# EasyEDA schematic d_00_e_02.json
TITLE: Sheet_1; REV: 1.0; Date: 2021-02-06; Sheet: 1/1; Drawn By: ghusk; Company: Your Company
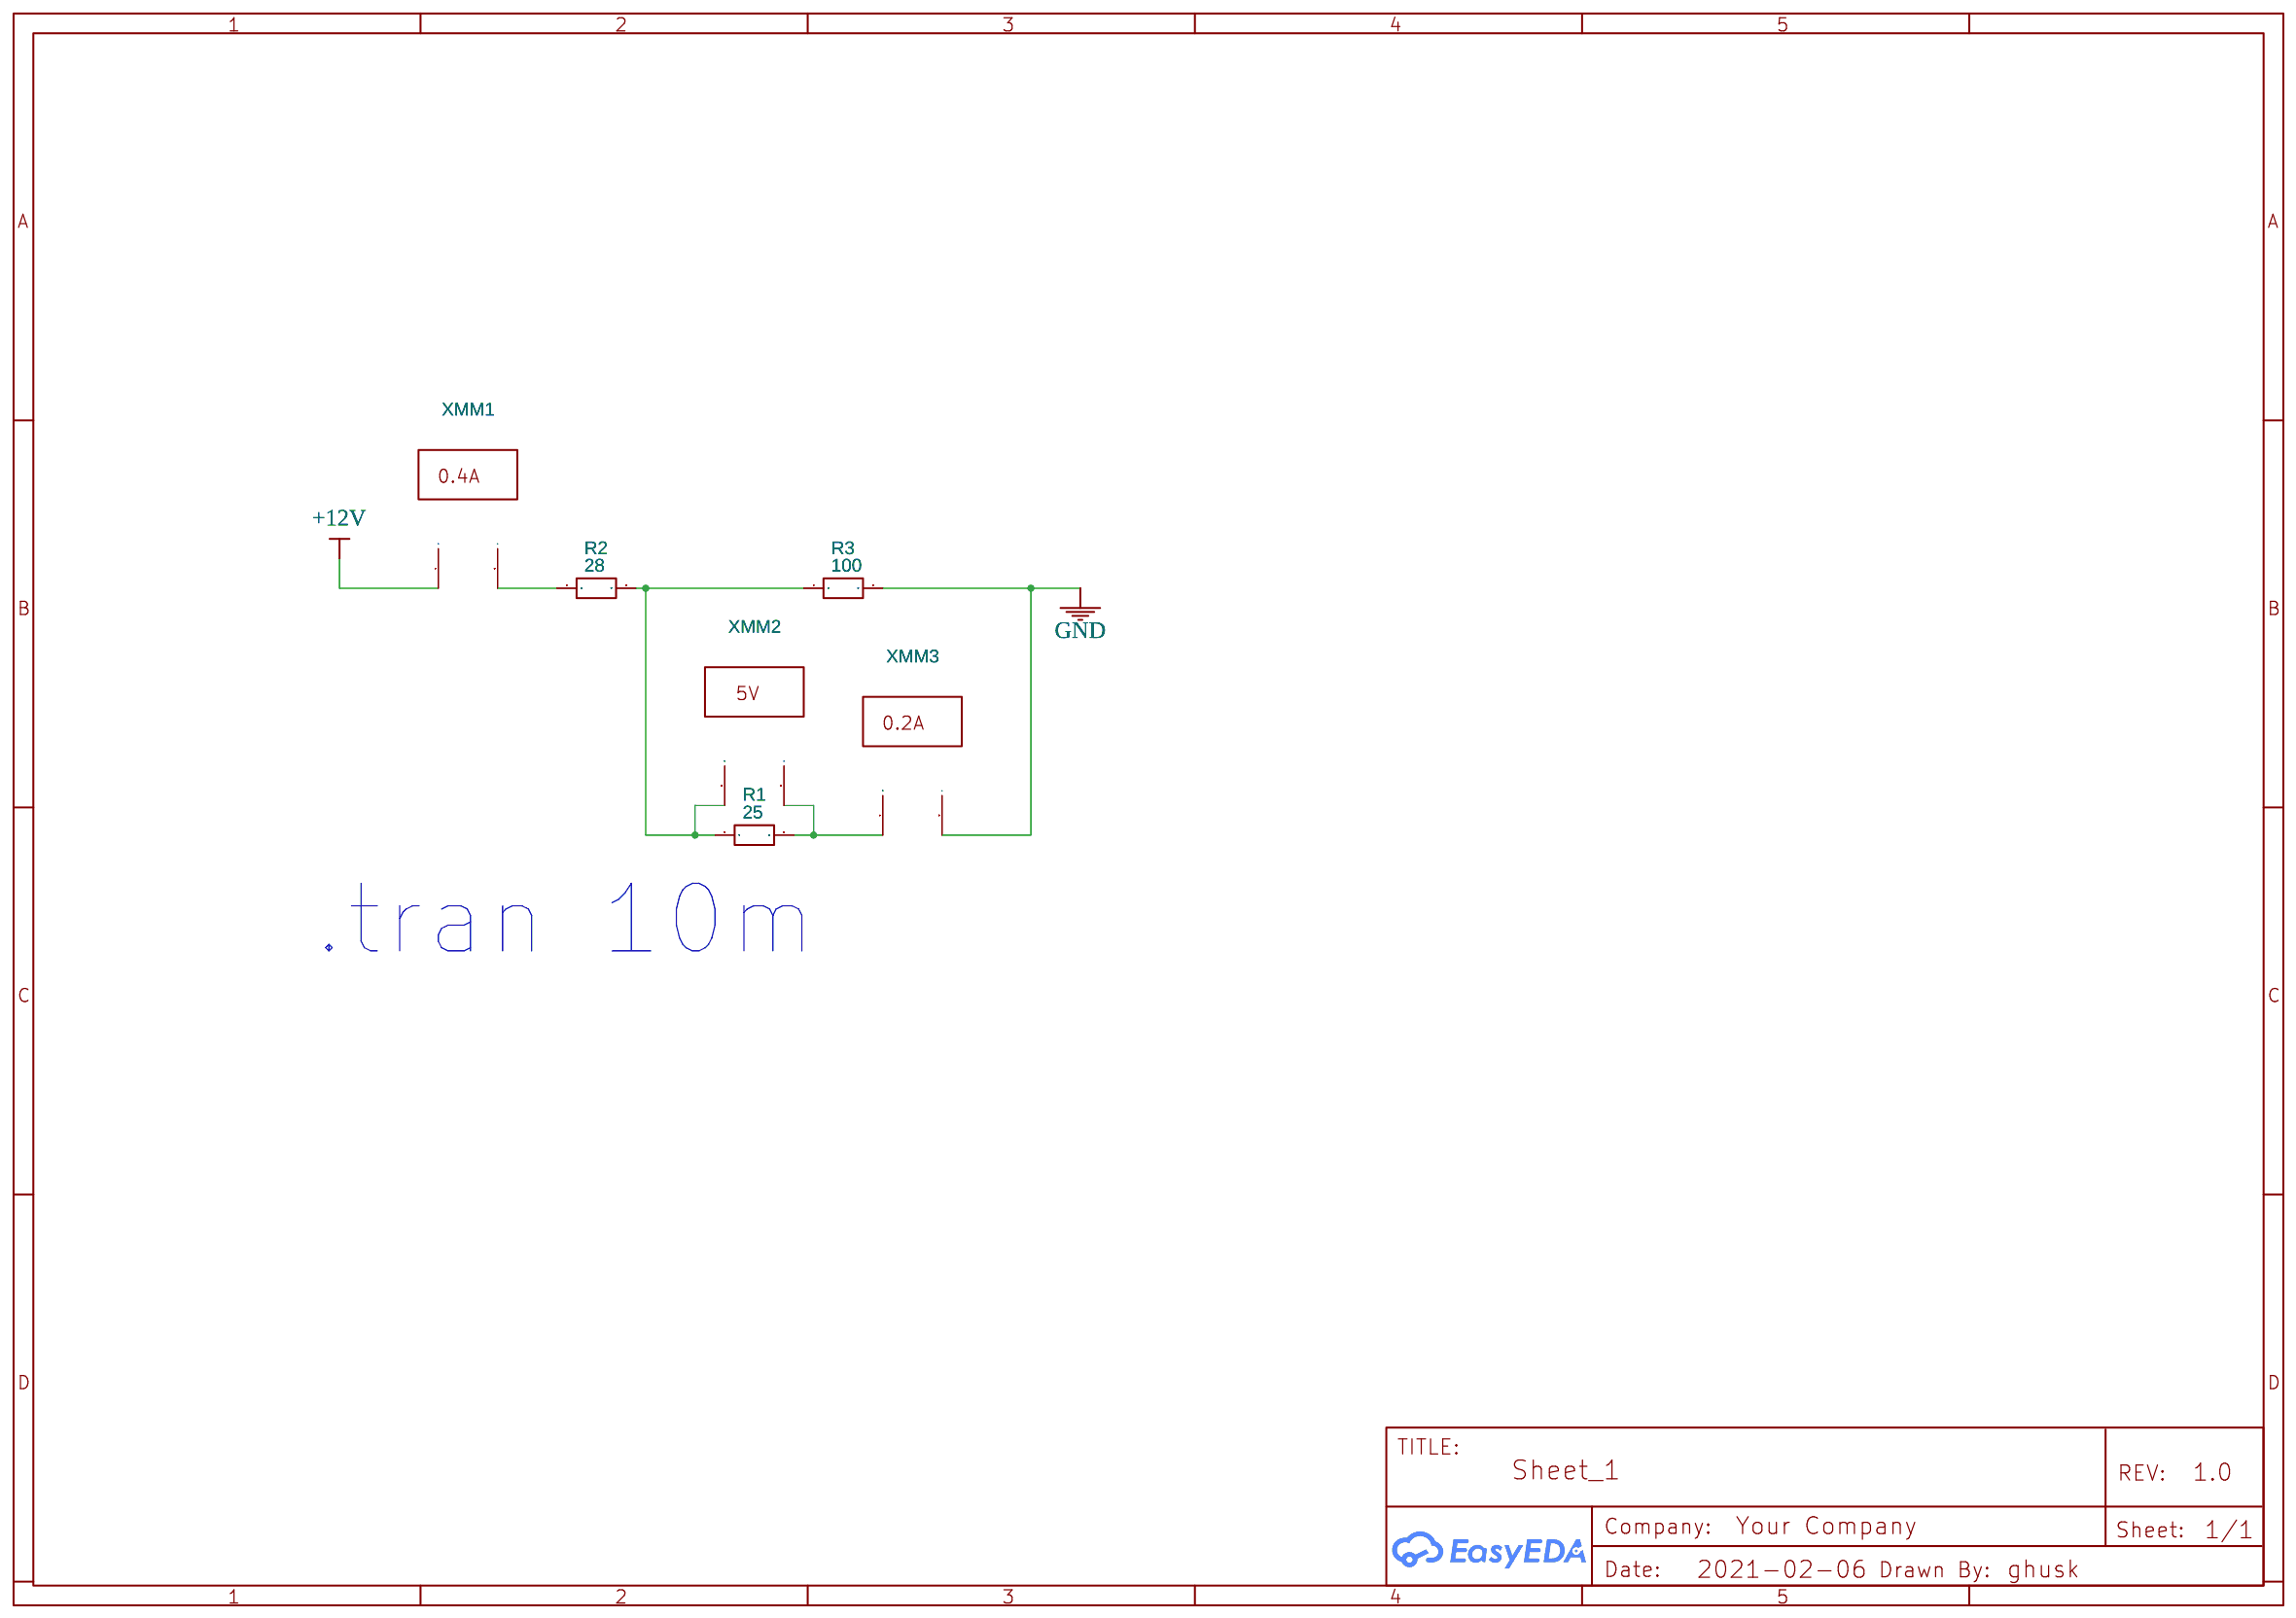
[diagram p0: schematic sheet]

## Parts
R1  25  [AXIAL-0.3]
R2  28  [AXIAL-0.3]
R3  100  [AXIAL-0.3]
XMM1  Multimeter
XMM2  Multimeter
XMM3  Multimeter

## Library data of the parts
R1-R3 = Resistor_EU: Contributor: EasyEDA; Resistance: 1K
XMM1 XMM3 = MULTIMETER: Supplier: LCSC; Multimeter Type: Amper; Power Type: AC; Voltmeter resistance: 10μ; Ammeter resistance: 1G; NameDisplay: 0; Contributor: EasyEDA; sim: true
XMM2 = MULTIMETER: Supplier: LCSC; Multimeter Type: Voltmeter; Power Type: AC; Voltmeter resistance: 10μ; Ammeter resistance: 1G; NameDisplay: 0; Contributor: EasyEDA; sim: true

## Nets
+12V: XMM1.1(+)
GND: R3.2 XMM3.2(I)
Net-(R1-1): R1.1 R2.2 R3.1 XMM2.1(+)
Net-(R1-2): R1.2 XMM2.2(I) XMM3.1(+)
Net-(R2-1): R2.1 XMM1.2(I)

## Notes on the sheet
- .tran 10m
